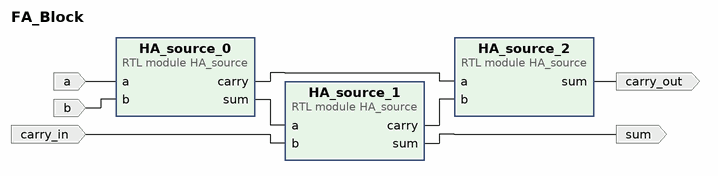
[diagram p0: block diagram of the top level]
# Vivado block design FA_Block, xc7a100tcsg324-1, Vivado 2020.1
create_bd_design FA_Block

create_bd_port -dir I a
create_bd_port -dir I b
create_bd_port -dir I carry_in
create_bd_port -dir O sum
create_bd_port -dir O carry_out

create_bd_cell -type module -reference HA_source HA_source_0
create_bd_cell -type module -reference HA_source HA_source_1
create_bd_cell -type module -reference HA_source HA_source_2

# ---- connections ----

connect_bd_net [get_bd_pins HA_source_0/sum] [get_bd_pins HA_source_1/a]
connect_bd_net [get_bd_pins HA_source_0/carry] [get_bd_pins HA_source_2/a]
connect_bd_net [get_bd_pins HA_source_1/carry] [get_bd_pins HA_source_2/b]
connect_bd_net -net a_0_1 [get_bd_ports a] [get_bd_pins HA_source_0/a]
connect_bd_net -net b_0_1 [get_bd_ports b] [get_bd_pins HA_source_0/b]
connect_bd_net -net b_1_1 [get_bd_ports carry_in] [get_bd_pins HA_source_1/b]
connect_bd_net [get_bd_pins HA_source_1/sum] [get_bd_ports sum]
connect_bd_net [get_bd_pins HA_source_2/sum] [get_bd_ports carry_out]

validate_bd_design
save_bd_design
